# Altium schematic sheet Noise Toaster.SchDoc: Noise Toaster - Top Level
size Letter; SheetNumber: 1; SheetTotal: 10
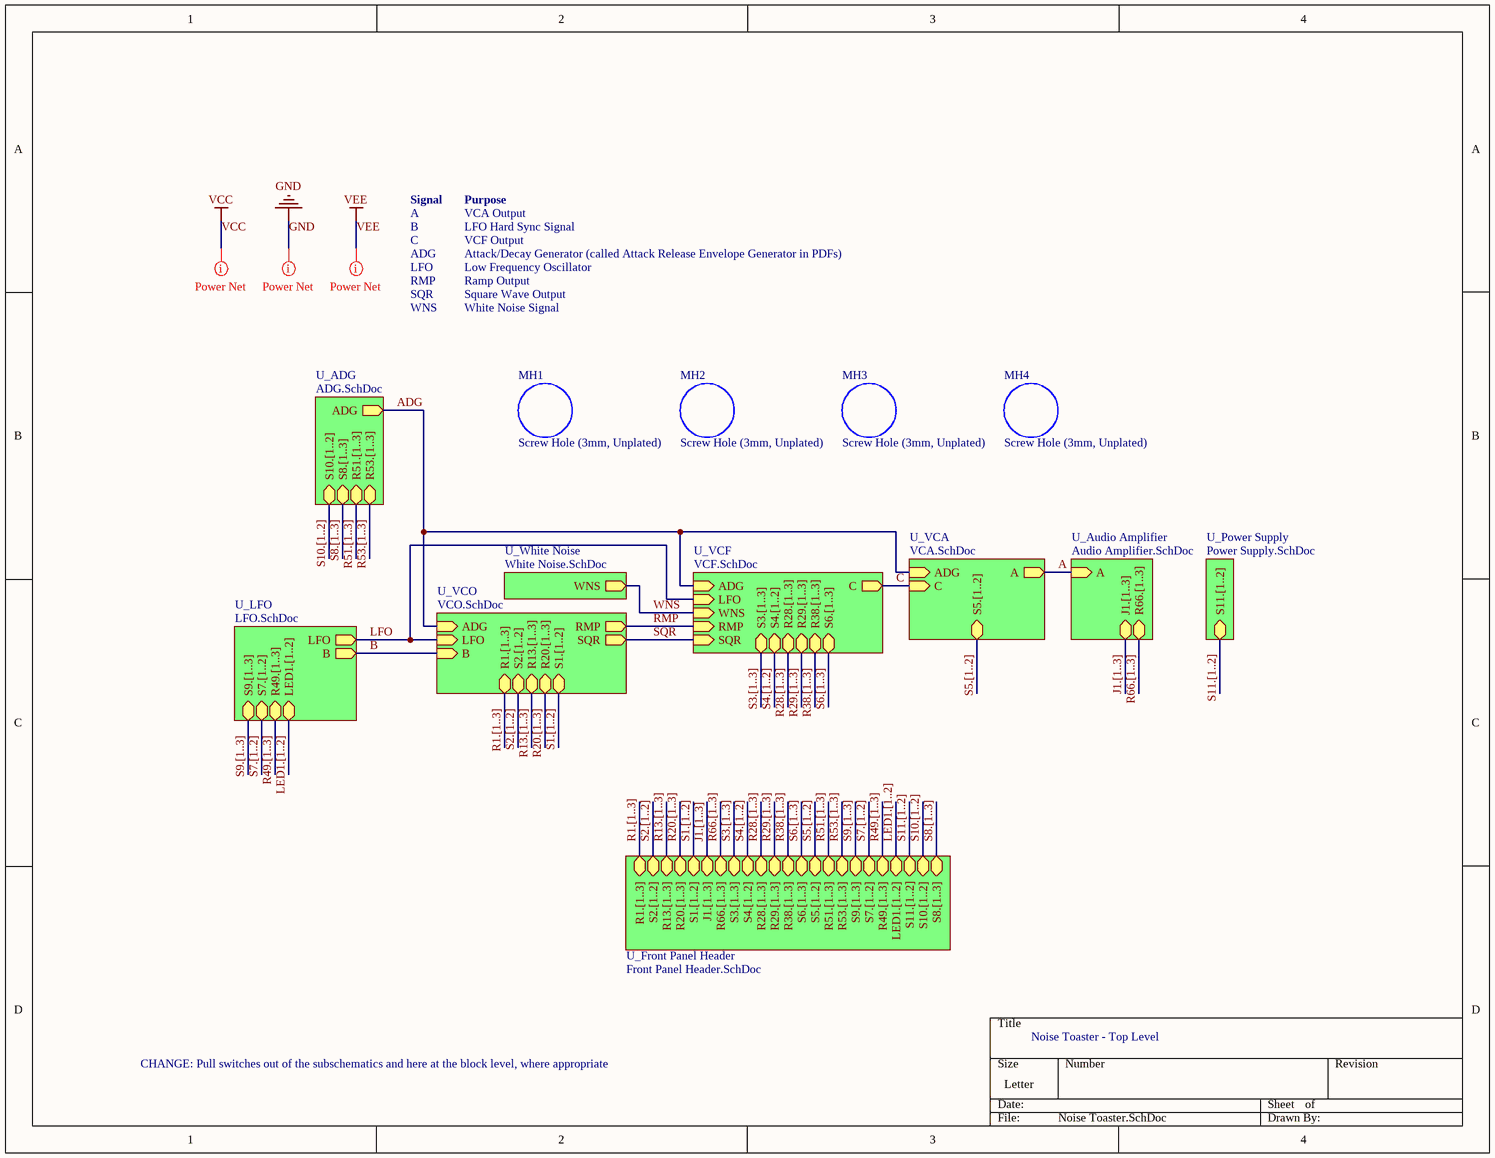
[diagram p0: Noise Toaster.SchDoc]

## Parts
MH1  Screw Hole (3mm, Unplated)  [SCREW HOLE (3MM, UNPLATED)]
MH2  Screw Hole (3mm, Unplated)  [SCREW HOLE (3MM, UNPLATED)]
MH3  Screw Hole (3mm, Unplated)  [SCREW HOLE (3MM, UNPLATED)]
MH4  Screw Hole (3mm, Unplated)  [SCREW HOLE (3MM, UNPLATED)]

## Sub-sheets
U_ADG = ADG.SchDoc: ADG (out), S10.[1..2] (bidir), S8.[1..3] (bidir), R51.[1..3] (bidir), R53.[1..3] (bidir)
U_Audio Amplifier = Audio Amplifier.SchDoc: A (in), J1.[1..3] (bidir), R66.[1..3] (bidir)
U_Front Panel Header = Front Panel Header.SchDoc: S5.[1..2] (bidir), R1.[1..3] (bidir), S2.[1..2] (bidir), R13.[1..3] (bidir), R20.[1..3] (bidir), S1.[1..2] (bidir), J1.[1..3] (bidir), R66.[1..3] (bidir), S3.[1..3] (bidir), S4.[1..2] (bidir), R28.[1..3] (bidir), R29.[1..3] (bidir), R38.[1..3] (bidir), S6.[1..3] (bidir), R51.[1..3] (bidir), R53.[1..3] (bidir), S9.[1..3] (bidir), S7.[1..2] (bidir), R49.[1..3] (bidir), LED1.[1..2] (bidir), S11.[1..2] (bidir), S10.[1..2] (bidir), S8.[1..3] (bidir)
U_LFO = LFO.SchDoc: LFO (out), B (out), S9.[1..3] (bidir), S7.[1..2] (bidir), R49.[1..3] (bidir), LED1.[1..2] (bidir)
U_Power Supply = Power Supply.SchDoc: S11.[1..2] (bidir)
U_VCA = VCA.SchDoc: A (out), C (in), ADG (in), S5.[1..2] (bidir)
U_VCF = VCF.SchDoc: SQR (in), RMP (in), WNS (in), LFO (in), ADG (in), C (out), S3.[1..3] (bidir), S4.[1..2] (bidir), R28.[1..3] (bidir), R29.[1..3] (bidir), R38.[1..3] (bidir), S6.[1..3] (bidir)
U_VCO = VCO.SchDoc: LFO (in), ADG (in), B (in), RMP (out), SQR (out), R1.[1..3] (bidir), S2.[1..2] (bidir), R13.[1..3] (bidir), R20.[1..3] (bidir), S1.[1..2] (bidir)
U_White Noise = White Noise.SchDoc: WNS (out)

## Nets
A: sheet U_Audio Amplifier/A, sheet U_VCA/A
ADG: sheet U_ADG/ADG, sheet U_VCO/ADG, sheet U_VCF/ADG, sheet U_VCA/ADG
B: sheet U_LFO/B, sheet U_VCO/B
C: sheet U_VCF/C, sheet U_VCA/C
LFO: sheet U_LFO/LFO, sheet U_VCO/LFO, sheet U_VCF/LFO
RMP: sheet U_VCO/RMP, sheet U_VCF/RMP
SQR: sheet U_VCO/SQR, sheet U_VCF/SQR
WNS: sheet U_White Noise/WNS, sheet U_VCF/WNS

## Buses and harness runs
bus J1.[1..3] = sheet U_Audio Amplifier/J1.[1..3]
bus J1.[1..3] = sheet U_Front Panel Header/J1.[1..3]
bus LED1.[1..2] = sheet U_Front Panel Header/LED1.[1..2]
bus LED1.[1..2] = sheet U_LFO/LED1.[1..2]
bus R1.[1..3] = sheet U_Front Panel Header/R1.[1..3]
bus R1.[1..3] = sheet U_VCO/R1.[1..3]
bus R13.[1..3] = sheet U_Front Panel Header/R13.[1..3]
bus R13.[1..3] = sheet U_VCO/R13.[1..3]
bus R20.[1..3] = sheet U_Front Panel Header/R20.[1..3]
bus R20.[1..3] = sheet U_VCO/R20.[1..3]
bus R28.[1..3] = sheet U_Front Panel Header/R28.[1..3]
bus R28.[1..3] = sheet U_VCF/R28.[1..3]
bus R29.[1..3] = sheet U_Front Panel Header/R29.[1..3]
bus R29.[1..3] = sheet U_VCF/R29.[1..3]
bus R38.[1..3] = sheet U_Front Panel Header/R38.[1..3]
bus R38.[1..3] = sheet U_VCF/R38.[1..3]
bus R49.[1..3] = sheet U_Front Panel Header/R49.[1..3]
bus R49.[1..3] = sheet U_LFO/R49.[1..3]
bus R51.[1..3] = sheet U_ADG/R51.[1..3]
bus R51.[1..3] = sheet U_Front Panel Header/R51.[1..3]
bus R53.[1..3] = sheet U_ADG/R53.[1..3]
bus R53.[1..3] = sheet U_Front Panel Header/R53.[1..3]
bus R66.[1..3] = sheet U_Audio Amplifier/R66.[1..3]
bus R66.[1..3] = sheet U_Front Panel Header/R66.[1..3]
bus S1.[1..2] = sheet U_Front Panel Header/S1.[1..2]
bus S1.[1..2] = sheet U_VCO/S1.[1..2]
bus S2.[1..2] = sheet U_Front Panel Header/S2.[1..2]
bus S2.[1..2] = sheet U_VCO/S2.[1..2]
bus S3.[1..3] = sheet U_Front Panel Header/S3.[1..3]
bus S3.[1..3] = sheet U_VCF/S3.[1..3]
bus S4.[1..2] = sheet U_Front Panel Header/S4.[1..2]
bus S4.[1..2] = sheet U_VCF/S4.[1..2]
bus S5.[1..2] = sheet U_Front Panel Header/S5.[1..2]
bus S5.[1..2] = sheet U_VCA/S5.[1..2]
bus S6.[1..3] = sheet U_Front Panel Header/S6.[1..3]
bus S6.[1..3] = sheet U_VCF/S6.[1..3]
bus S7.[1..2] = sheet U_Front Panel Header/S7.[1..2]
bus S7.[1..2] = sheet U_LFO/S7.[1..2]
bus S8.[1..3] = sheet U_ADG/S8.[1..3]
bus S8.[1..3] = sheet U_Front Panel Header/S8.[1..3]
bus S9.[1..3] = sheet U_Front Panel Header/S9.[1..3]
bus S9.[1..3] = sheet U_LFO/S9.[1..3]
bus S10.[1..2] = sheet U_ADG/S10.[1..2]
bus S10.[1..2] = sheet U_Front Panel Header/S10.[1..2]
bus S11.[1..2] = sheet U_Front Panel Header/S11.[1..2]
bus S11.[1..2] = sheet U_Power Supply/S11.[1..2]

## Layout directives
net class POWER; rule Width Constraint [Pref Width = 20mil    Min Width = 10mil    Max Width = 20mil]: GND, VCC, VEE

## Notes on the sheet
- Signal
- A
- B
- Purpose
- VCA Output
- LFO Hard Sync Signal
- C
- ADG
- LFO
- RMP
- SQR
- VCF Output
- Attack/Decay Generator (called Attack Release Envelope Generator in PDFs)
- Low Frequency Oscillator
- Ramp Output
- Square Wave Output
- WNS
- White Noise Signal
- CHANGE: Pull switches out of the subschematics and here at the block level, where appropriate

## Library data of the parts
MH1-MH4 = Screw Hole (3mm, Unplated): 3mm unplated plus washer keepout